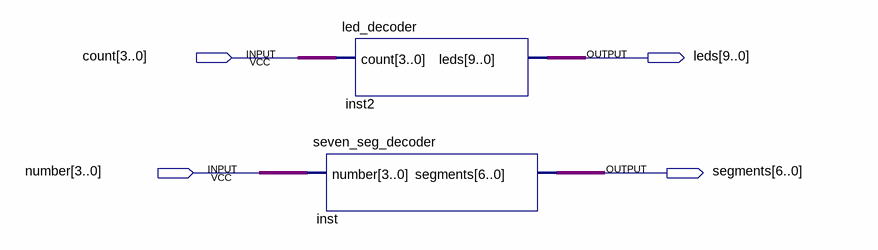
[diagram p0: schematic sheet]
// Quartus schematic Lab10_top_level_test.bdf as structural Verilog: 2 symbols, 4 pins
module Lab10_top_level_test (
  input  [3:0] count,
  input  [3:0] number,
  output [9:0] leds,
  output [6:0] segments
);

  seven_seg_decoder inst (.number(number), .segments(segments));
  led_decoder inst2 (.count(count), .leds(leds));
endmodule
